# Altium schematic sheet 11-IMU.SchDoc
size A4
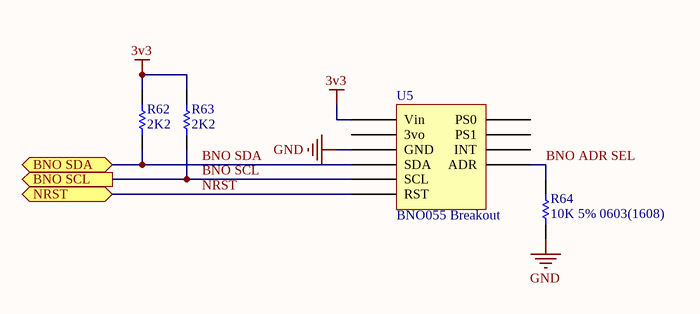
[diagram p0: 11-IMU.SchDoc]

## Parts
R62  2K2  [RESC0603(1608)_N]
R63  2K2  [RESC0603(1608)_N]
R64  10K 5% 0603(1608)  [RESC0603(1608)_N]
U5  BNO055 Breakout  [BNO055]

## Ports
BNO SCL (out), BNO SDA (bidir), NRST (bidir)

## Nets
3v3: R62.2 R63.2 U5.1(Vin)
GND: R64.1 U5.3(GND)
BNO ADR SEL: R64.2 U5.10(ADR)
BNO SCL: R63.1 U5.5(SCL) ; port BNO SCL
BNO SDA: R62.1 U5.4(SDA) ; port BNO SDA
NRST: U5.6(RST) ; port NRST

Not connected (* = marked no-connect by the designer): U5 2(3vo) 7(PS0) 8(PS1) 9(INT)

## Library data of the parts
R62 R63 = CMP-1012-00082-1: 2K2 0.1W 5% 0603 (1608 Metric)  SMD; Case-Metric: 1608; Value: 2200.00 Ohm; Case-EIA: 0603; Power: 0.1 W; Tolerance: 5 %; Technology: SMT
R64 = CMP-1012-00098-1: 10K 0.1W 5% 0603 (1608 Metric)  SMD; Case-EIA: 0603; Value: 10000.00 Ohm; Case-Metric: 1608; Technology: SMT; Tolerance: 5 %; Power: 0.1 W